# EAGLE design rudder_shield (EAGLE 6.3)
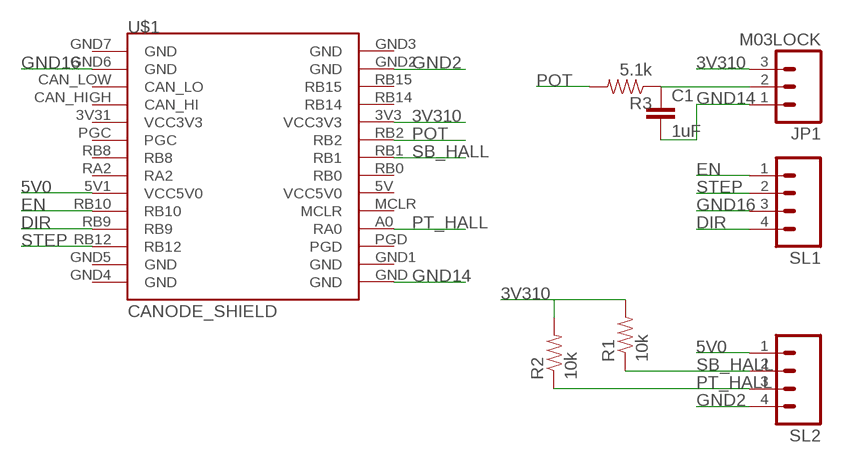
[diagram p0: schematic, sheet 1]

## Parts
C1  1uF  CAP1206  [1206]
JP1  M03LOCK  [1X03_LOCK]
R1  10k  RESISTOR0805-RES  [0805]
R2  10k  RESISTOR0805-RES  [0805]
R3  5.1k  RESISTOR0805-RES  [0805]
SL1  M04LOCK  [1X04_LOCK]
SL2  M04LOCK  [1X04_LOCK]
U$1  CANODE_SHIELD  [CANODE_SHIELD]

## Nets
3V310: JP1.3 R1.2 R2.2 U$1.3V3(VCC3V3)
5V0: SL2.1 U$1.5V1(VCC5V0)
DIR [small]: SL1.4 U$1.RB9
EN [small]: SL1.1 U$1.RB10
GND2: SL2.4 U$1.GND2(GND)
GND14: C1.2 JP1.1 U$1.GND
GND16 [small]: SL1.3 U$1.GND6(GND)
N$1: C1.1 JP1.2 R3.1
POT: R3.2 U$1.RB2
PT_HALL: R2.1 SL2.3 U$1.A0(RA0)
SB_HALL: R1.1 SL2.2 U$1.RB1
STEP [small]: SL1.2 U$1.RB12
Unconnected: U$1.3V31(VCC3V3) U$1.5V(VCC5V0) U$1.CAN_HIGH(CAN_HI) U$1.CAN_LOW(CAN_LO) U$1.GND1(GND) U$1.GND3(GND) U$1.GND4(GND) U$1.GND5(GND) U$1.GND7(GND) U$1.MCLR U$1.PGC U$1.PGD U$1.RA2 U$1.RB0 U$1.RB8 U$1.RB14 U$1.RB15

## Library data of the parts
C1 = ASL:CAP: Capacitor Standard 0603 ceramic capacitor, and 0.1" leaded capacitor.
JP1 = ASL:M03: Header 3 Standard 3-pin 0.1" header. Use with straight break away headers (SKU : PRT-00116), right angle break away headers (PRT-00553), swiss pins (PRT-00743), machine pins (PRT-00117), and female headers (PRT-00115). Molex polarized connector foot print use with SKU : PRT-08232 with associated crimp pins and housings.
R1-R3 = ASL:RESISTOR: Resistor Basic schematic elements and footprints for 0603, 1206, and PTH resistors.
SL1 SL2 = ASL:M04: AMP QUICK CONNECTOR
U$1 = ASL:CANODE_SHIELD: This part provides an outline of the CANode to facilitate developing shield boards. Note that this does not show the position of the mounting holes for the 4-40 screws, which should be .12" holes centered in the 4 circles in the corners.

## Net classes
1 small: width 0.203 mm

## Board
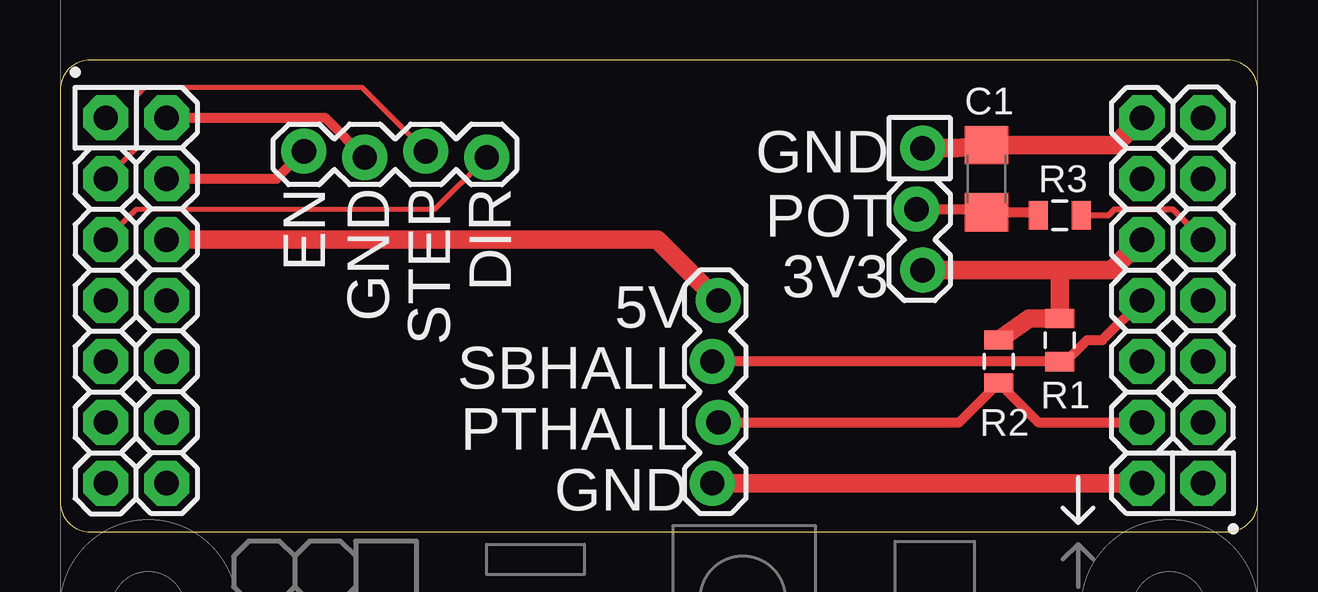
[diagram p1: board, top side]

Size 49.91 x 19.68 mm. Coordinates in mm from the lower left corner, seen from the top.
Outline: 0,18.41 0,1.27 arc90 1.27,0 48.64,0 arc90 49.91,1.27 49.91,18.41 arc90 48.64,19.68 1.27,19.68 arc90 0,18.41
Copper layers (1*16): Top 0.035mm / dielectric 1.5mm / Bottom 0.035mm
Design rules "default *": minimum track width 8mil, minimum drill 0.6mm, track to track 10mil, track to pad 8mil, pad to pad 10mil, via to via 10mil, smd to smd 8mil, copper to edge 30mil, drill to drill 8mil, minimum pad ring 10mil, minimum via ring 20mil, stop-mask expansion 4mil, vias tented up to drill 0mil, thermal gap 10mil

### Footprints (pad centres in the part's own frame; a part is rotated, then mirrored left to right if it is on the bottom)
1206 = smd 1.6 x 1.8: 1 -1.4,0; 2 1.4,0
1X03_LOCK = drill 1.016 pad 1.88: 1 0,0.127; 2 2.54,-0.127; 3 5.08,0.127
0805 = smd 0.8 x 1.2: 1 -0.9,0; 2 0.9,0
1X04_LOCK = drill 1.016 pad 1.88: 1 0,0.127; 2 2.54,-0.127; 3 5.08,0.127; 4 7.62,-0.127
CANODE_SHIELD = drill 1.016 pad 1.88 octagon: 3V3 45.085,19.05; 3V31 4.445,13.97; 5V 45.085,13.97; 5V1 4.445,19.05; A0 45.085,11.43; CAN_HIGH 1.905,11.43; CAN_LOW 4.445,11.43; GND 45.085,24.13; GND1 47.625,24.13; GND2 45.085,8.89; GND3 47.625,8.89; GND4 4.445,8.89; GND5 1.905,8.89; GND6 4.445,24.13; GND7 1.905,24.13; MCLR 47.625,13.97; PGC 1.905,13.97; PGD 47.625,11.43; RA2 1.905,16.51; RB0 47.625,16.51; RB1 45.085,16.51; RB2 47.625,19.05; RB8 4.445,16.51; RB9 4.445,21.59; RB10 1.905,19.05; RB12 1.905,21.59; RB14 47.625,21.59; RB15 45.085,21.59

### Placement (x,y rotation side)
C1  38.61,14.73 90 top
JP1  35.81,16 270 top
R1  41.66,8 90 top
R2  39.12,7.11 90 top
R3  41.66,13.21 0 top
SL1  17.78,15.75 180 top
SL2  27.3,9.65 270 top
U$1  0,-6.86 0 top

### Tracks (layer width: path | path; a pad name or v marks a point on that pad's centre or on a via)
3V310
  Top 0.762: 41.66,10.92 43.81,10.92 U$1.3V3 | 41.66,10.92 R1.2 40.39,8.9 R2.2 | JP1.3 41.66,10.92
5V0
  Top 0.762: U$1.5V1 24.89,12.19 SL2.1
DIR
  Top 0.406: U$1.RB9 9.02,14.73 SL1.4
EN
  Top 0.203: U$1.RB10 3.17,13.46 15.62,13.46 SL1.1
GND2
  Top 0.762: SL2.4 U$1.GND2
GND14
  Top 0.254: 37.47,16 C1.2
  Top 0.762: JP1.1 37.34,16 C1.2 43.95,16.13 U$1.GND
GND16
  Top 0.406: U$1.GND6 11.05,17.27 SL1.3
N$1
  Top 0.406: JP1.2 38.92,13.46 | 39.12,13.46 38.92,13.46 | 38.92,13.46 arc45 C1.1 40.46,13.33 arc-45 R3.1
POT
  Top 0.254: U$1.RB2 46.35,13.46 43.94,13.46 43.69,13.21 R3.2
PT_HALL
  Top 0.406: SL2.3 37.48,4.57 R2.1 40.76,4.57 U$1.A0
SB_HALL
  Top 0.406: U$1.RB1 43.43,8 42.8,8 41.91,7.11 | 41.91,7.11 R1.1 | 41.91,7.11 SL2.2
STEP
  Top 0.203: U$1.RB12 3.17,16 3.17,18.16 3.56,18.54 12.57,18.54 SL1.2

### Text on the board
tPlace: GND | EN | GND | STEP | DIR | POT | 3V3 | 5V | SBHALL | PTHALL | GND